# EasyEDA schematic EZ_Looper.json
TITLE: LoopFX_Sheet-1; REV: 1.0; Date: 2023-07-27; Sheet: 1/1; Company: Your Company
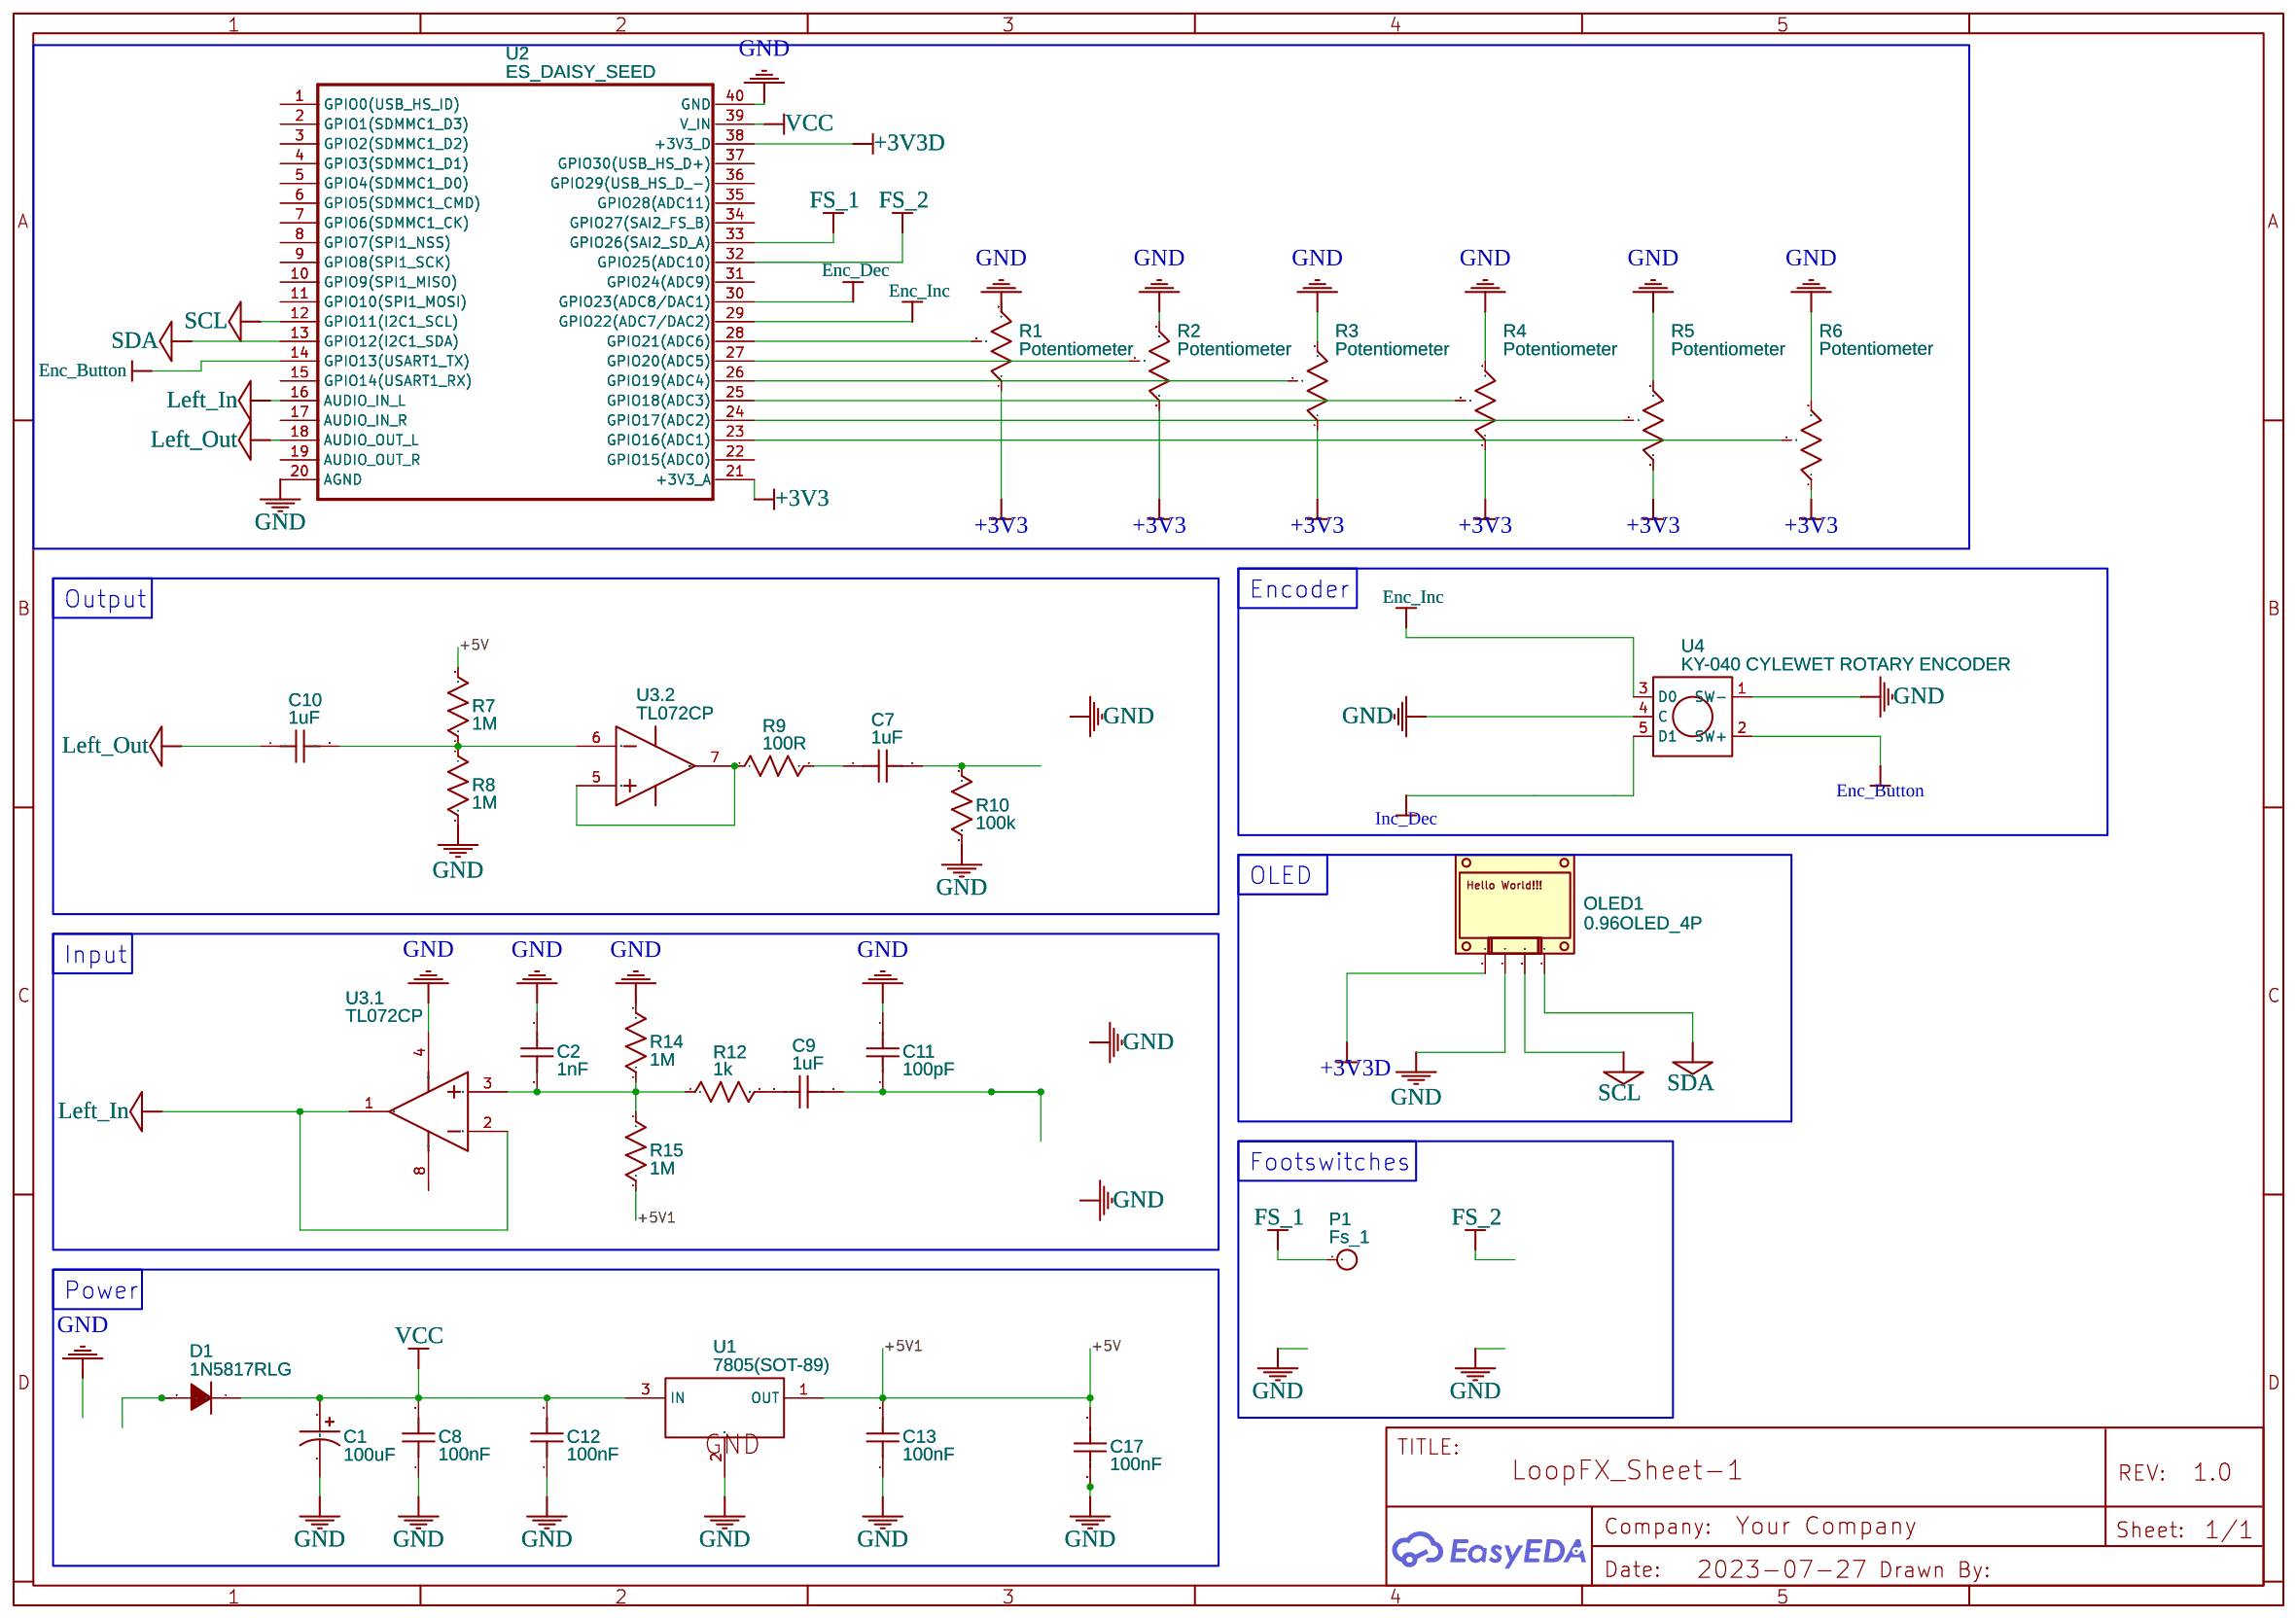
[diagram p0: schematic sheet]

## Parts
C1  100uF  [CAP-4*5]
C2  1nF  [CAP-TH_L7.5-W4.0-P5.00-D0.6-1]
C7  1uF  [CAP-TH_L6.0-W5.0-P5.00-D1.0]
C8  100nF  [CAP-TH_L12.0-W5.5-P10.00-D1.0]
C9  1uF  [CAP-TH_L6.0-W5.0-P5.00-D1.0]
C10  1uF  [CAP-TH_L6.0-W5.0-P5.00-D1.0]
C11  100pF  [CAP-TH_L4.8-W3.2-P5.08-D0.5]
C12  100nF  [CAP-TH_L12.0-W5.5-P10.00-D1.0]
C13  100nF  [CAP-TH_L12.0-W5.5-P10.00-D1.0]
C17  100nF  [CAP-TH_L12.0-W5.5-P10.00-D1.0]
D1  1N5817RLG  [DO-15_BD3.1-L6.7-P10.70-D0.9-RD]
OLED1  0.96OLED_4P  [0.96OLED_4P]
P1  Fs_1  [3MMHOLE_PTH]
R1  Potentiometer  [POTENTIOMETER]
R2  Potentiometer  [POTENTIOMETER]
R3  Potentiometer  [POTENTIOMETER]
R4  Potentiometer  [POTENTIOMETER]
R5  Potentiometer  [POTENTIOMETER]
R6  Potentiometer  [POTENTIOMETER]
R7  1M  [RC20]
R8  1M  [RC20]
R9  100R  [RC20]
R10  100k  [RC20]
R12  1k  [RC20]
R14  1M  [RC20]
R15  1M  [RC20]
U1  7805(SOT-89)  [SOT-89-3_L4.5-W2.5-P1.50-LS4.2-BR]
U2  ES_DAISY_SEED  [ES_DAISY_SEED]
U3  TL072CP  [DIP-8_L9.6-W6.4-P2.54-LS7.6-BL-1]  (sections 1,2)
U4  KY-040 CYLEWET ROTARY ENCODER  [KY-040 CYLEWET ROTARY ENCODER]

## Library data of the parts
C1 = C_Tan_SMD_A_US: Contributor: LCEDA_Lib
C2 = B33A182KD238075085040EOY: Supplier: LCSC; Supplier Part: C2892932; Manufacturer: STE(松田); JLCPCB Part Class: Extended Part; Contributor: lcsc
C7 C9 C10 = CT4G-1210-X5R-63V-10μF-M: Contributor: LCSC; Supplier: LCSC; Supplier Part: C454419; Manufacturer: TORCH(火炬); JLCPCB Part Class: Extended Part
C8 C12 C13 C17 = KP104J2J1006: Contributor: LCSC; Supplier: LCSC; Supplier Part: C390130; Manufacturer: KYET(科雅); JLCPCB Part Class: Extended Part
C11 = CC4-0805-CG -50V-100pF-J: Contributor: LCSC; Supplier: LCSC; Supplier Part: C123146; Manufacturer: TORCH(火炬); JLCPCB Part Class: Extended Part
D1 = 1N5817RLG: Contributor: LCSC; Supplier: LCSC; Supplier Part: C232461; Manufacturer: onsemi(安森美); JLCPCB Part Class: Extended Part
OLED1 = 0.96OLED_4P: Supplier: LCSC; Contributor: LCEDA_Lib
P1 = 3MMHOLE_PTH: Contributor: Components
R1-R6 = Potentiometer: Contributor: FlySkiller
R7-R10 R12 R14 R15 = R_0603_US: Contributor: LCEDA_Lib
U1 = 7805(SOT-89): Supplier: LCSC; Manufacturer: CJ; Manufacturer Part: CJ78L05; image: //image.lceda.cn/szlcsc/C2079.jpg; Supplier Part: C2079; Paste Type: expand; Contributor: LCEDA_Lib
U2 = ES_DAISY_SEED: Contributor: weasel
U3 = TL072CP: tags: FET Operational Amplifier; subpart_no: 1; Supplier Part: C7236; Supplier: LCSC; Manufacturer: TI(德州仪器); JLCPCB Part Class: Extended Part
U4 = KY-040 CYLEWET ROTARY ENCODER: Manufacturer Part: KY-040; Contributor: ivansk222

## Nets
+3V3: R1.1 R2.1 R3.1 R4.1 R5.1 R6.1 U2.21(+3V3_A)
+3V3D: OLED1.1 U2.38(+3V3_D)
+5V: C13.2 C17.2 R7.2 R15.2 U1.1(OUT)
GND: C1.2 C2.1 C8.1 C11.1 C12.1 C13.1 C17.1 OLED1.2 R1.3 R2.3 R3.3 R4.3 R5.3 R6.3 R8.2 R10.2 R14.2 U1.2(GND) U2.20(AGND) U2.40(GND) U3.4(VCC-) U4.1(SW-) U4.4(C)
VCC: C1.1 C8.2 C12.2 D1.1(C) U1.3(IN) U2.39(V_IN)
Enc_Button: U2.14(GPIO13(USART1_TX)) U4.2(SW+)
Enc_Dec: U2.30(GPIO23(ADC8/DAC1))
Enc_Inc: U2.29(GPIO22(ADC7/DAC2)) U4.3(D0)
FS_1: P1.1 U2.33(GPIO26(SAI2_SD_A))
FS_2: U2.32(GPIO25(ADC10))
Inc_Dec: U4.5(D1)
Left_In: U2.16(AUDIO_IN_L) U3.1(OUT1) U3.2(IN1-)
Left_Out: C10.1 U2.18(AUDIO_OUT_L)
SCL: OLED1.3 U2.12(GPIO11(I2C1_SCL))
SDA: OLED1.4 U2.13(GPIO12(I2C1_SDA))
Net-(C2-2): C2.2 R12.1 R14.1 R15.1 U3.3(IN1+)
Net-(C7-1): C7.1 R9.2
Net-(C7-2): C7.2 R10.1
Net-(C9-1): C9.1 R12.2
Net-(C9-2): C9.2 C11.2
Net-(C10-2): C10.2 R7.1 R8.1 U3.6(IN2-)
Net-(R1-2): R1.2 U2.28(GPIO21(ADC6))
Net-(R2-2): R2.2 U2.27(GPIO20(ADC5))
Net-(R3-2): R3.2 U2.26(GPIO19(ADC4))
Net-(R4-2): R4.2 U2.25(GPIO18(ADC3))
Net-(R5-2): R5.2 U2.24(GPIO17(ADC2))
Net-(R6-2): R6.2 U2.23(GPIO16(ADC1))
Net-(R9-1): R9.1 U3.5(IN2+) U3.7(OUT2)

Not connected (* = marked no-connect by the designer): D1 2(A); U2 1(GPIO0(USB_HS_ID)) 2(GPIO1(SDMMC1_D3)) 3(GPIO2(SDMMC1_D2)) 4(GPIO3(SDMMC1_D1)) 5(GPIO4(SDMMC1_D0)) 6(GPIO5(SDMMC1_CMD)) 7(GPIO6(SDMMC1_CK)) 8(GPIO7(SPI1_NSS)) 9(GPIO8(SPI1_SCK)) 10(GPIO9(SPI1_MISO)) 11(GPIO10(SPI1_MOSI)) 15(GPIO14(USART1_RX)) 17(AUDIO_IN_R) 19(AUDIO_OUT_R) 22(GPIO15(ADC0)) 31(GPIO24(ADC9)) 34(GPIO27(SAI2_FS_B)) 35(GPIO28(ADC11)) 36(GPIO29(USB_HS_D_-)) 37(GPIO30(USB_HS_D+)); U3 8(VCC+)

## Notes on the sheet
- Encoder
- Output
- OLED
- Input
- Footswitches
- Power
